# EAGLE design RF_INPUT (EAGLE 7.4.0)
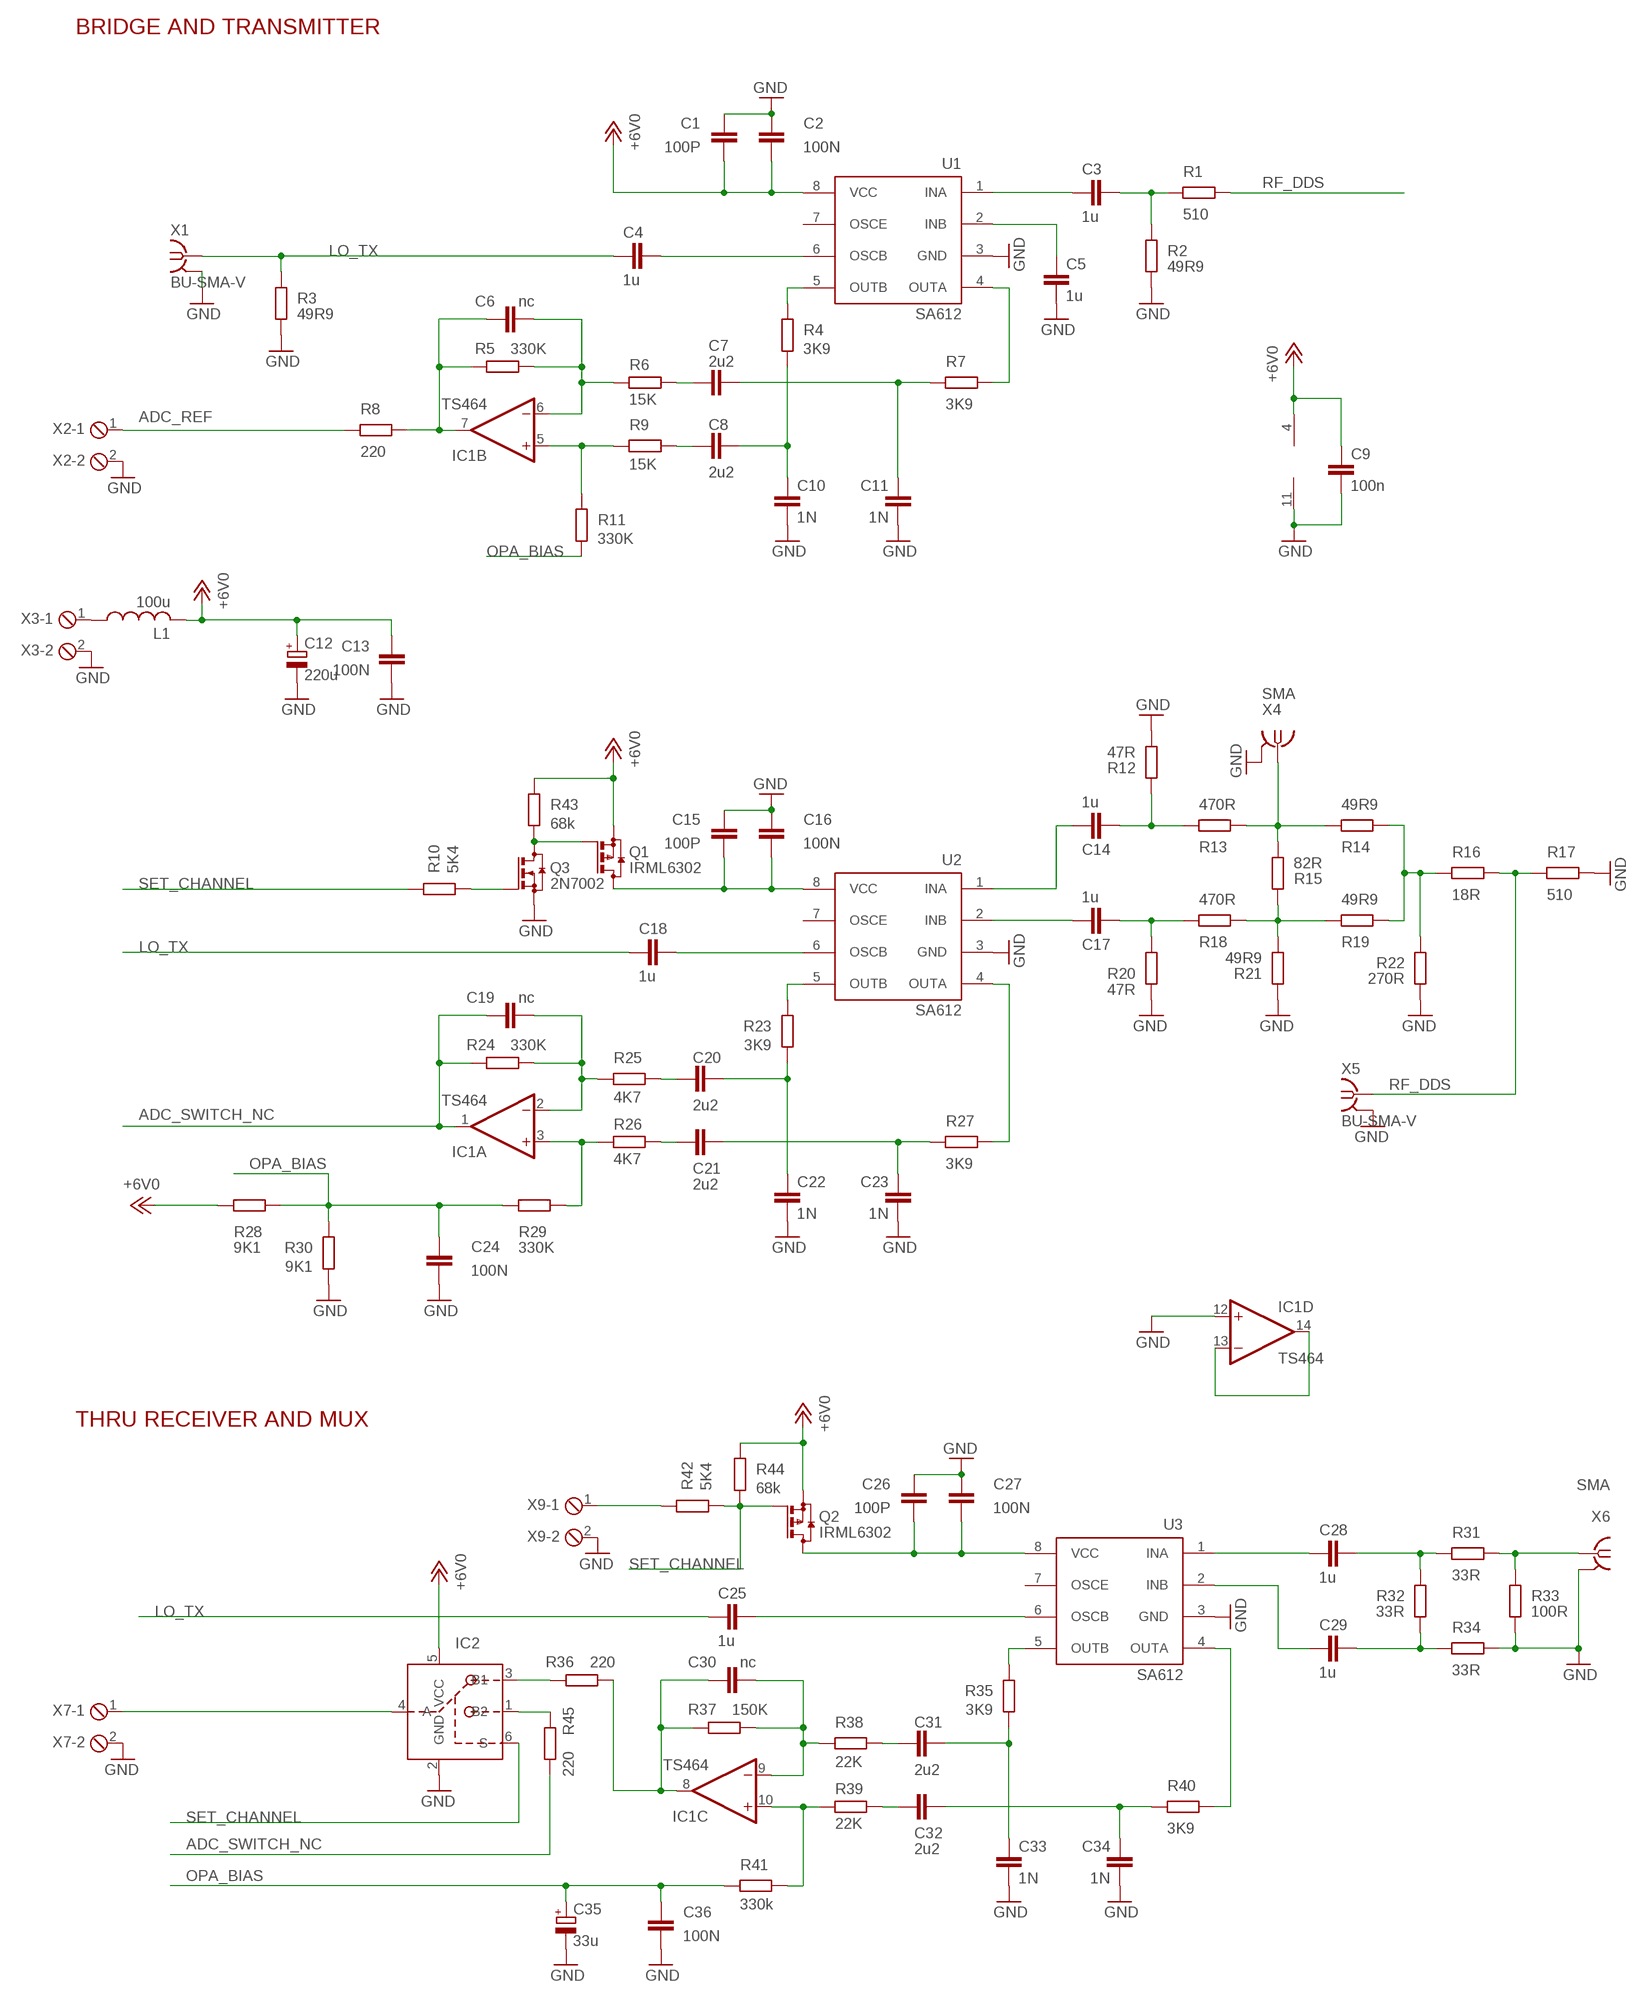
[diagram p0: schematic, sheet 1]

## Parts
C1  100P  C-EUC0805  [C0805]
C2  100N  C-EUC0603  [C0603]
C3  1u  C-EUC0603  [C0603]
C4  1u  C-EUC0805  [C0805]
C5  1u  C-EUC0603  [C0603]
C6  nc  C-EUC0805  [C0805]
C7  2u2  C-EUC0805  [C0805]
C8  2u2  C-EUC0805  [C0805]
C9  100n  C-EUC0603  [C0603]
C10  1N  C-EUC0805  [C0805]
C11  1N  C-EUC0805  [C0805]
C12  220u  CPOL-EU153CLV-0605  [153CLV-0605]
C13  100N  C-EUC0603  [C0603]
C14  1u  C-EUC0603  [C0603]
C15  100P  C-EUC0805  [C0805]
C16  100N  C-EUC0603  [C0603]
C17  1u  C-EUC0603  [C0603]
C18  1u  C-EUC0805  [C0805]
C19  nc  C-EUC0805  [C0805]
C20  2u2  C-EUC0805  [C0805]
C21  2u2  C-EUC0805  [C0805]
C22  1N  C-EUC0805  [C0805]
C23  1N  C-EUC0805  [C0805]
C24  100N  C-EUC0603  [C0603]
C25  1u  C-EUC0805  [C0805]
C26  100P  C-EUC0805  [C0805]
C27  100N  C-EUC0603  [C0603]
C28  1u  C-EUC0603  [C0603]
C29  1u  C-EUC0603  [C0603]
C30  nc  C-EUC0805  [C0805]
C31  2u2  C-EUC0805  [C0805]
C32  2u2  C-EUC0805  [C0805]
C33  1N  C-EUC0805  [C0805]
C34  1N  C-EUC0805  [C0805]
C35  33u  CPOL-EU153CLV-0605  [153CLV-0605]
C36  100N  C-EUC0603  [C0603]
IC1  TS464  AD8684R  [SO14]
IC2  SN74LVC1G3157DBVR  [SOT23-6]
L1  100u  L-US0207/12  [0207/12]
Q1  IRML6302  BSS84  [SOT23]
Q2  IRML6302  BSS84  [SOT23]
Q3  2N7002  BSS123  [SOT23]
R1  510  R-EU_R0603  [R0603]
R2  49R9  R-EU_R0805  [R0805]
R3  49R9  R-EU_R0805  [R0805]
R4  3K9  R-EU_R0603  [R0603]
R5  330K  R-EU_R0603  [R0603]
R6  15K  R-EU_R0603  [R0603]
R7  3K9  R-EU_R0603  [R0603]
R8  220  R-EU_R0603  [R0603]
R9  15K  R-EU_R0603  [R0603]
R10  5K4  R-EU_R0603  [R0603]
R11  330K  R-EU_R0603  [R0603]
R12  47R  R-EU_R0603  [R0603]
R13  470R  R-EU_R0603  [R0603]
R14  49R9  R-EU_R0805  [R0805]
R15  82R  R-EU_R0603  [R0603]
R16  18R  R-EU_R0603  [R0603]
R17  510  R-EU_R0603  [R0603]
R18  470R  R-EU_R0603  [R0603]
R19  49R9  R-EU_R0805  [R0805]
R20  47R  R-EU_R0603  [R0603]
R21  49R9  R-EU_R0805  [R0805]
R22  270R  R-EU_R0603  [R0603]
R23  3K9  R-EU_R0603  [R0603]
R24  330K  R-EU_R0603  [R0603]
R25  4K7  R-EU_R0603  [R0603]
R26  4K7  R-EU_R0603  [R0603]
R27  3K9  R-EU_R0603  [R0603]
R28  9K1  R-EU_R0603  [R0603]
R29  330K  R-EU_R0603  [R0603]
R30  9K1  R-EU_R0603  [R0603]
R31  33R  R-EU_R0603  [R0603]
R32  33R  R-EU_R0603  [R0603]
R33  100R  R-EU_R0603  [R0603]
R34  33R  R-EU_R0603  [R0603]
R35  3K9  R-EU_R0603  [R0603]
R36  220  R-EU_R0603  [R0603]
R37  150K  R-EU_R0603  [R0603]
R38  22K  R-EU_R0603  [R0603]
R39  22K  R-EU_R0603  [R0603]
R40  3K9  R-EU_R0603  [R0603]
R41  330k  R-EU_R0603  [R0603]
R42  5K4  R-EU_R0603  [R0603]
R43  68k  R-EU_R0603  [R0603]
R44  68k  R-EU_R0603  [R0603]
R45  220  R-EU_R0603  [R0603]
U1  SA612  [SO8]
U2  SA612  [SO8]
U3  SA612  [SO8]
X1  BU-SMA-V  [BU-SMA-V]
X2  MPT2  [2POL254]
X3  MPT2  [2POL254]
X4  SMA  SMA-142-0701-801/806  [J502-ND-142-0701-801/806]
X5  BU-SMA-V  [BU-SMA-V]
X6  SMA  SMA-142-0701-801/806  [J502-ND-142-0701-801/806]
X7  MPT2  [2POL254]
X9  MPT2  [2POL254]

## Nets
+6V0: C1.1 C2.1 C9.1 C12.+ C13.1 IC1.4(P:V+) IC2.5(VCC) L1.2 Q1.2(S) Q2.2(S) R28.2 R43.1 R44.1 U1.8(VCC)
ADC_REF: R8.1 X2.1
ADC_SWITCH_NC: C19.1 IC1.1(A:OUT) R24.2 R45.1
ADC_SWITCH_NO: C30.1 IC1.8(C:OUT) R36.1 R37.2
ADC_SWITCH_NO2: C6.1 IC1.7(B:OUT) R5.2 R8.2
GND: C1.2 C2.2 C5.2 C9.2 C10.2 C11.2 C12.- C13.2 C15.2 C16.2 C22.2 C23.2 C24.1 C26.2 C27.2 C33.2 C34.2 C35.- C36.2 IC1.11(P:V-) IC1.12(D:+IN) IC2.2(GND) Q3.2(S) R2.1 R3.2 R12.2 R17.2 R20.1 R21.1 R22.2 R30.2 R33.2 R34.1 U1.3(GND) U2.3(GND) U3.3(GND) X1.2 X1.3 X1.4 X1.5 X2.2 X3.2 X4.G@1 X4.G@2 X4.G@3 X4.G@4 X5.2 X5.3 X5.4 X5.5 X6.G@1 X6.G@2 X6.G@3 X6.G@4 X7.2 X9.2
LO_TX: C4.1 C18.1 C25.1 R3.1 X1.1
N$1: R15.1 R18.1 R19.2 R21.2
N$2: IC2.3(B1) R36.2
N$3: C25.2 U3.6(OSCB)
N$4: C26.1 C27.1 Q2.3(D) U3.8(VCC)
N$5: R13.1 R14.2 R15.2 X4.1
N$6: Q1.1(G) Q3.3(D) R43.2
N$7: L1.1 X3.1
N$8: C15.1 C16.1 Q1.3(D) U2.8(VCC)
N$9: R42.1 X9.1
N$11: IC2.1(B2) R45.2
N$12: IC2.4(A) X7.1
N$14: Q3.1(G) R10.2
N$30: R31.1 R33.1 X6.1
N$31: C28.2 R31.2 R32.1
N$32: C29.2 R32.2 R34.2
N$33: C29.1 U3.2(INB)
N$34: C28.1 U3.1(INA)
N$35: C31.2 C33.1 R35.2
N$36: R40.1 U3.4(OUTA)
N$37: C32.2 C34.1 R40.2
N$38: R35.1 U3.5(OUTB)
N$39: C17.1 U2.2(INB)
N$41: C30.2 IC1.9(C:-IN) R37.1 R38.2
N$42: C17.2 R18.2 R20.2
N$43: C31.1 R38.1
N$44: C32.1 R39.1
N$46: IC1.13(D:-IN) IC1.14(D:OUT)
N$47: IC1.10(C:+IN) R39.2 R41.1
N$49: C14.1 U2.1(INA)
N$51: C20.2 C22.1 R23.2
N$52: R27.1 U2.4(OUTA)
N$53: C21.2 C23.1 R27.2
N$54: R23.1 U2.5(OUTB)
N$55: C19.2 IC1.2(A:-IN) R24.1 R25.2
N$56: C20.1 R25.1
N$57: C21.1 R26.1
N$59: IC1.3(A:+IN) R26.2 R29.1
N$60: C14.2 R12.1 R13.2
N$61: C18.2 U2.6(OSCB)
N$62: C5.1 U1.2(INB)
N$63: R14.1 R16.2 R19.1 R22.1
N$64: C3.1 U1.1(INA)
N$65: C8.2 C10.1 R4.2
N$66: R7.1 U1.4(OUTA)
N$67: C7.2 C11.1 R7.2
N$68: R4.1 U1.5(OUTB)
N$69: C6.2 IC1.6(B:-IN) R5.1 R6.2
N$70: C8.1 R9.1
N$71: C7.1 R6.1
N$73: IC1.5(B:+IN) R9.2 R11.1
N$74: C3.2 R1.2 R2.2
N$76: C4.2 U1.6(OSCB)
OPA_BIAS: C24.2 C35.+ C36.1 R11.2 R28.1 R29.2 R30.1 R41.2
RF_DDS: R1.1 R16.1 R17.1 X5.1
SET_CHANNEL: IC2.6(S) Q2.1(G) R10.1 R42.2 R44.2
Unconnected: U1.7(OSCE) U2.7(OSCE) U3.7(OSCE)

## Notes on the sheet
- BRIDGE AND TRANSMITTER
- THRU RECEIVER AND MUX

## Library data of the parts
C1-C11 C13-C34 C36 = rcl:C-EU: CAPACITOR, European symbol
C12 C35 = rcl:CPOL-EU: POLARIZED CAPACITOR, European symbol
IC1 = linear:AD8684: Quad Low Power, High Speed JFET Operational Amplifiers Source: http://www.analog.com/UploadedFiles/Data_Sheets/AD8682_8684.pdf
IC2 = balmer:SN74LVC1G3157DBVR: SINGLE-POLE DOUBLE-THROW ANALOG SWITCH
L1 = rcl:L-US: INDUCTOR, American symbol
Q1 Q2 = transistor-small-signal:BSS84: P-CHANNEL MOS FET
Q3 = transistor-small-signal:BSS123: N-CHANNEL MOS FET
R1-R45 = rcl:R-EU_: RESISTOR, European symbol
U1-U3 = vnwa:SA612
X1 X5 = con-coax:BU-SMA-V: FEMALE SMA CONNECTOR Radiall distributor RS 112-3794; OC_FARNELL: unknown; OC_NEWARK: unknown
X2 X3 X7 X9 = con-phoenix-254:MPT2: PHOENIX CONNECTOR; OC_FARNELL: unknown; OC_NEWARK: unknown
X4 X6 = con-coax:SMA-: SMA 50 Ohm End Launch Jack Receptacle - Round Contact Johnson Components Source: www.johnsoncomponents.com .. J502-ND.pdf; MF: JOHNSON COMPONENTS; MPN: 142-0701-801; OC_FARNELL: 1608592; OC_NEWARK: 90F2624

## Board
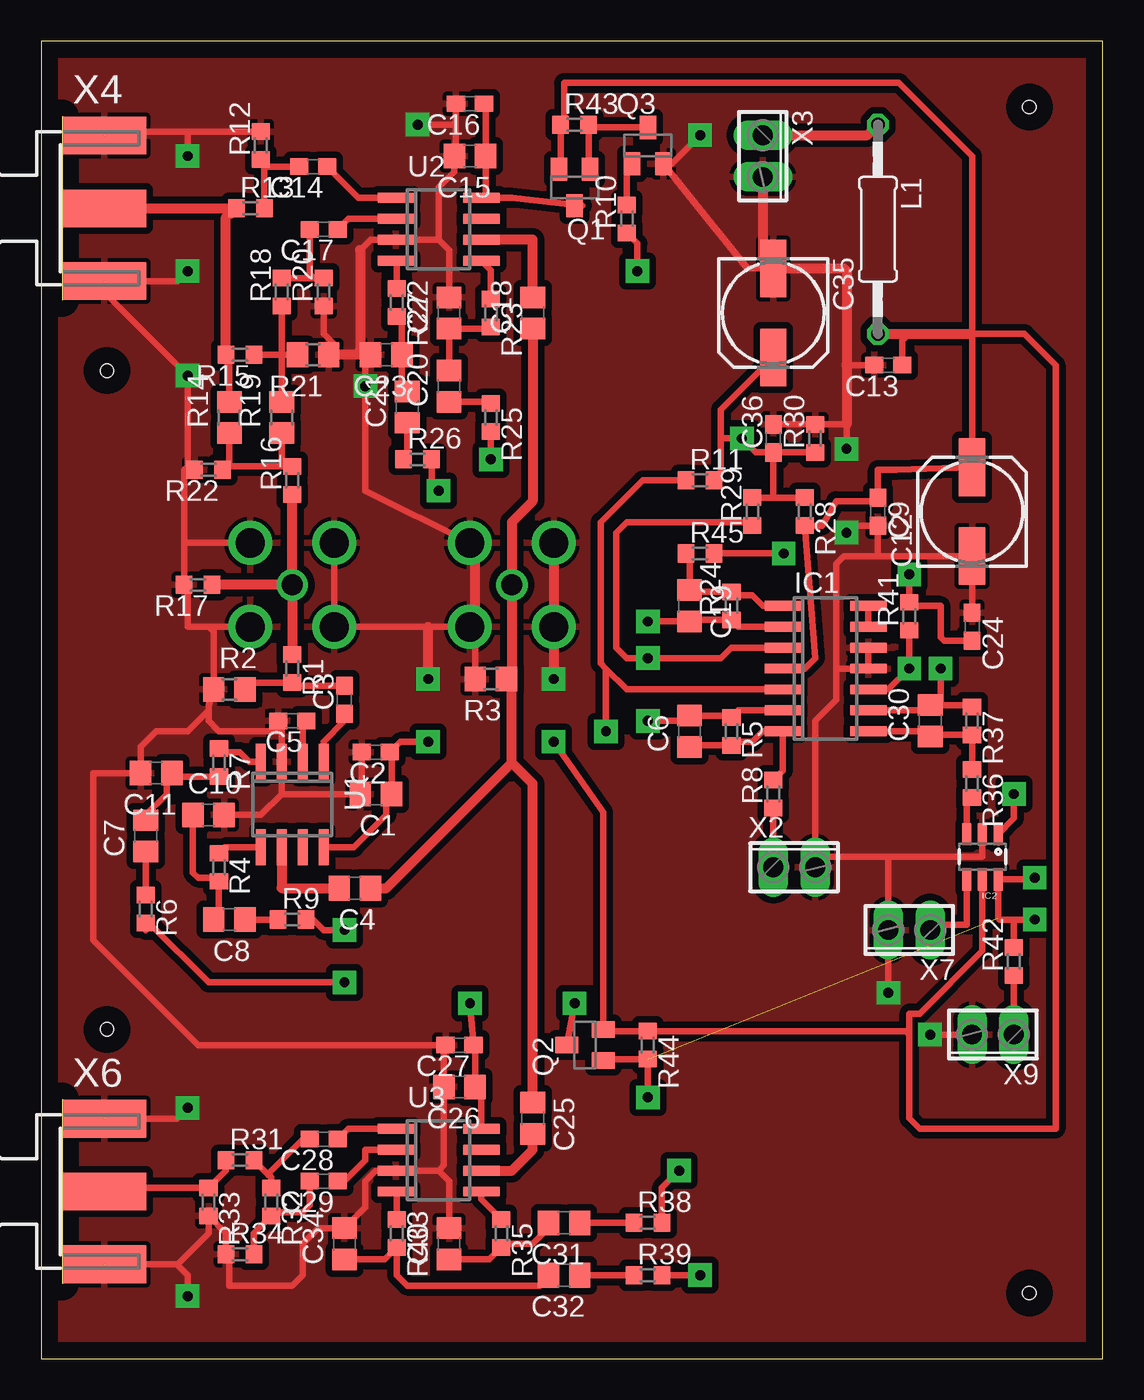
[diagram p1: board, top side]
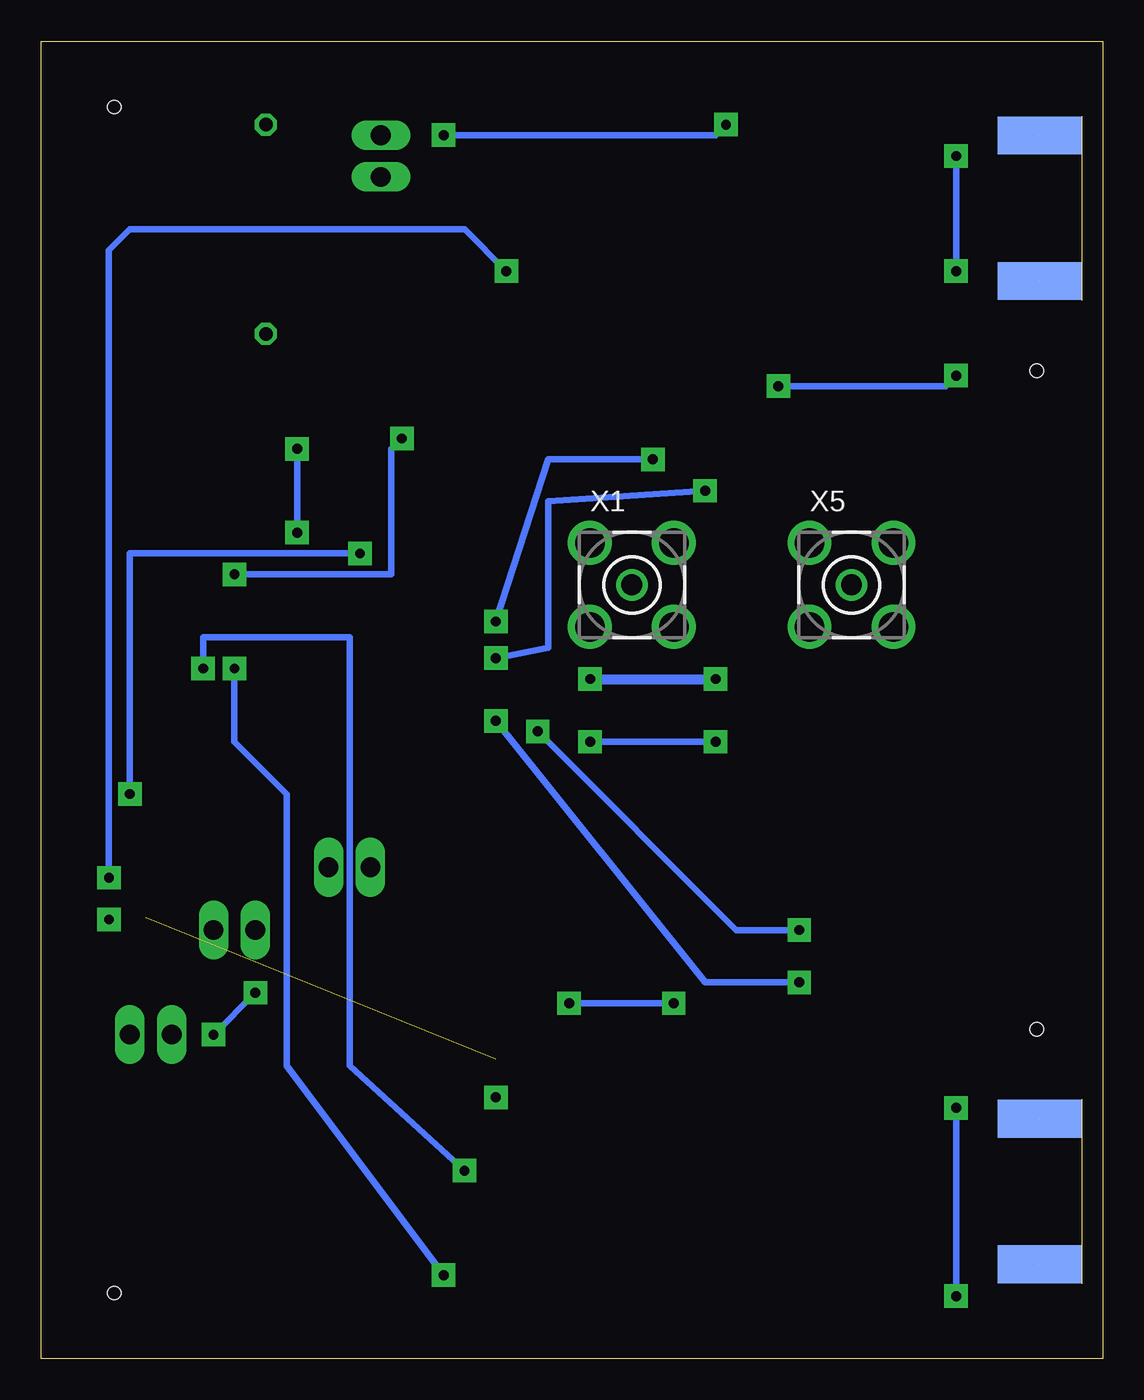
[diagram p2: board, bottom side, seen from below]

Size 64.44 x 80 mm. Coordinates in mm from the lower left corner, seen from the top.
Outline: 0,0 64.44,0 64.44,80 0,80 0,0
Copper layers (1*16): Top 0.035mm / dielectric 1.5mm / Bottom 0.035mm
Design rules "default": minimum track width 10mil, minimum drill 24mil, track to track 8mil, track to pad 8mil, pad to pad 8mil, via to via 8mil, smd to smd 8mil, copper to edge 40mil, drill to drill 8mil, minimum pad ring 10mil, minimum via ring 8mil, stop-mask expansion 4mil, vias tented up to drill 0mil, thermal gap 10mil
Holes 0.8 mm at 4,20 4,60 60,4 60,76

### Footprints (pad centres in the part's own frame; a part is rotated, then mirrored left to right if it is on the bottom)
C0805 = smd 1.3 x 1.5: 1 -0.95,0; 2 0.95,0
C0603 = smd 1.1 x 1: 1 -0.85,0; 2 0.85,0
153CLV-0605 = smd 3.5 x 1.6: + 2.7,0; - -2.7,0
SO14 = smd 0.6 x 2.2: 1 -3.81,-2.6; 2 -2.54,-2.6; 3 -1.27,-2.6; 4 0,-2.6; 5 1.27,-2.6; 6 2.54,-2.6; 7 3.81,-2.6; 8 3.81,2.6; 9 2.54,2.6; 10 1.27,2.6; 11 0,2.6; 12 -1.27,2.6; 13 -2.54,2.6; 14 -3.81,2.6
SOT23-6 = smd 0.55 x 1.35: 1 -0.95,-1.375; 2 0,-1.375; 3 0.95,-1.375; 4 0.95,1.375; 5 0,1.375; 6 -0.95,1.375
0207/12 = drill 0.813 octagon: 1 -6.35,0; 2 6.35,0
SOT23 = smd 1 x 1.4: 1 -0.95,-1.1; 2 0.95,-1.1; 3 0,1.1
R0603 = smd 1 x 1.1: 1 -0.85,0; 2 0.85,0
R0805 = smd 1.3 x 1.5: 1 -0.95,0; 2 0.95,0
SO8 = smd 0.6 x 2.2: 1 -1.905,-2.6; 2 -0.635,-2.6; 3 0.635,-2.6; 4 1.905,-2.6; 5 1.905,2.6; 6 0.635,2.6; 7 -0.635,2.6; 8 -1.905,2.6
BU-SMA-V = drill 1.27: 1 0,0 | drill 1.778: 2 -2.55,2.55; 3 2.55,2.55; 4 2.55,-2.55; 5 -2.55,-2.55
2POL254 = drill 1.2 long: 1 -1.27,0; 2 1.27,0
J502-ND-142-0701-801/806 = smd 5.08 x 2.286: 1 2.565,0; G@1 2.565,4.42; G@2 2.565,-4.42 | smd 5.08 x 2.286 bottom: G@3 2.565,4.42; G@4 2.565,-4.42

### Placement (x,y rotation side)
C1  20.32,34.29 180 top
C2  20.32,36.83 180 top
C3  18.41,40.01 90 top
C4  19.05,28.57 180 top
C5  15.24,38.73 180 top
C6  39.37,38.1 90 top
C7  6.35,31.75 90 top
C8  11.43,26.67 180 top
C9  50.8,51.44 270 top
C10  10.16,33.02 0 top
C11  6.99,35.56 180 top
C12  56.52,51.44 90 top
C13  51.44,60.33 180 top
C14  16.51,72.39 180 top
C15  26.04,73.03 180 top
C16  26.04,76.2 180 top
C17  17.14,68.58 180 top
C18  29.84,63.5 90 top
C19  39.37,45.72 270 top
C20  24.77,59.05 90 top
C21  22.23,57.78 90 top
C22  24.77,63.5 90 top
C23  20.95,60.96 180 top
C24  56.52,44.45 270 top
C25  29.84,14.61 270 top
C26  25.4,16.51 180 top
C27  25.4,19.05 180 top
C28  17.14,13.34 180 top
C29  17.14,10.79 180 top
C30  53.98,38.73 90 top
C31  31.75,8.26 180 top
C32  31.75,5.08 180 top
C33  24.77,6.99 90 top
C34  18.41,6.99 90 top
C35  44.45,63.5 270 top
C36  44.45,55.88 90 top
IC1  47.62,41.91 270 top
IC2  57.15,30.48 180 top
L1  50.8,68.58 270 top
Q1  32.38,71.12 180 top
Q2  33.02,19.05 90 top
Q3  36.83,73.66 0 top
R1  15.24,41.91 270 top
R2  11.43,40.64 0 top
R3  27.3,41.27 180 top
R4  10.79,29.84 270 top
R5  41.91,38.1 270 top
R6  6.35,27.3 270 top
R7  10.79,36.2 270 top
R8  44.45,34.29 90 top
R9  15.24,26.67 0 top
R10  35.56,69.22 90 top
R11  40.01,53.34 0 top
R12  13.34,73.66 90 top
R13  12.7,69.85 0 top
R14  11.43,57.15 90 top
R15  12.06,60.96 180 top
R16  15.24,53.34 90 top
R17  9.53,46.99 180 top
R18  14.61,64.77 90 top
R19  14.61,57.15 90 top
R20  17.14,64.77 90 top
R21  16.51,60.96 180 top
R22  10.16,53.98 180 top
R23  27.3,63.5 270 top
R24  41.91,45.72 90 top
R25  27.3,57.15 270 top
R26  22.86,54.61 0 top
R27  21.59,64.14 270 top
R28  46.35,51.44 270 top
R29  43.18,51.44 90 top
R30  46.99,55.88 90 top
R31  12.06,12.06 0 top
R32  13.97,9.53 270 top
R33  10.16,9.53 270 top
R34  12.06,6.35 0 top
R35  27.94,7.62 270 top
R36  56.52,34.92 270 top
R37  56.52,38.73 270 top
R38  36.83,8.26 0 top
R39  36.83,5.08 0 top
R40  21.59,7.62 270 top
R41  52.7,45.09 90 top
R42  59.05,24.13 90 top
R43  32.38,74.93 0 top
R44  36.83,19.05 270 top
R45  40.01,48.9 0 top
U1  15.24,33.66 180 top
U2  24.13,68.58 270 top
U3  24.13,12.06 270 top
X1  28.57,46.99 0 bottom
X2  45.72,29.84 0 top
X3  43.81,73.03 270 top
X4  1.27,69.85 0 top
X5  15.24,46.99 0 bottom
X6  1.27,10.16 0 top
X7  52.7,26.04 180 top
X9  57.78,19.68 180 top

### Tracks (layer width: path | path; a pad name or v marks a point on that pad's centre or on a via)
+6V0  (via drill 0.6 pad 1.42)
  Top 0.406: IC1.4 46.35,41.91 46.99,42.55 R28.2 47.41,50.59 48.26,52.07 50.59,52.07 C9.1 50.8,53.98 51.91,53.98 C12.+ 56.52,62.23 | Q1.2 31.54,72.32 R43.1 31.75,75.14 31.75,77.47 52.07,77.47 56.52,73.03 56.52,62.23 | U1.8 18.99,31.05 20.95,33.02 20.95,33.98 C1.1 21.27,36.73 C2.1 21.8,37.47 v23.5,37.47 | v31.11,37.47 34.12,33.19 Q2.2 34.22,19.9 R44.1 52.49,19.9 52.7,19.68 | C13.1 52.28,61.81 52.7,62.23 | IC2.5 57.15,24.77 53.34,20.95 52.7,20.95 52.7,19.68 | 56.52,62.23 59.69,62.23 61.59,60.33 61.59,13.97 53.34,13.97 52.7,14.61 52.7,19.68
  Top 0.61: L1.2 52.7,62.23 56.52,62.23
  Bottom 0.406: v31.11,37.47 v23.5,37.47
ADC_REF
  Top 0.406: X2.1 R8.1
ADC_SWITCH_NC
  Top 0.406: IC1.1 43.81,45.72 43.18,46.35 42.12,46.35 R24.2 39.47,46.57 C19.1 39.37,48.68 R45.1
ADC_SWITCH_NO
  Top 0.406: IC1.8 53.66,38.1 C30.1 54.08,37.88 R37.2 R36.1
ADC_SWITCH_NO2
  Top 0.406: R8.2 45.02,35.72 IC1.7 43.81,38.1 43.18,37.47 42.12,37.47 R5.2 39.47,37.25 C6.1
GND  (via drill 0.6 pad 1.42)  (4 unrouted)
  Top 0.406: 10.16,44.45 8.89,44.45 8.89,46.99 R17.2 8.68,49.53 | 10.16,44.45 X5.4 | R22.2 8.68,53.98 | 8.68,53.98 8.68,49.53 | 8.68,53.98 8.89,54.19 v8.89,59.69 3.83,64.75 X4.G@4 8.28,65.43 v8.89,66.04 | R12.2 8.89,74.51 | 8.89,74.51 4.08,74.51 X4.G@3 | C22.2 24.77,67.31 24.13,67.94 | 24.13,67.94 U2.3 20,67.94 19.37,67.31 | 8.26,5.71 10.16,7.62 R33.2 11.21,7.62 R34.1 11.43,6.13 11.43,4.45 15.24,4.45 15.88,5.08 15.88,6.99 16.82,7.93 C34.2 19.68,9.21 19.68,10.79 20.32,11.43 U3.3 24.13,11.43 | X6.G@4 8.23,5.74 8.26,5.71 | C33.2 24.77,10.79 24.13,11.43 | C16.2 25.18,74.93 | 25.18,74.93 25.18,73.12 C15.2 25.09,72.08 24.13,71.12 24.13,67.94 | 24.13,11.43 24.45,11.75 C26.2 24.45,18.95 C27.2 9.53,19.05 3.17,25.4 3.17,35.56 C11.2 6.04,37.15 6.99,38.1 8.89,38.1 10.16,39.37 | X6.G@3 8.23,14.58 v8.89,15.24 | v8.89,3.81 8.89,5.08 8.26,5.71 | 48.26,41.91 48.26,40.01 46.99,38.73 X2.2 47.62,30.48 51.44,30.48 | 48.26,41.91 IC1.11 IC1.12 | IC2.2 57.15,30.48 51.44,30.48 | 50.8,48.73 C12.- C24.1 | 50.8,48.73 48.73,48.73 48.26,48.26 48.26,41.91 | 50.8,48.73 C9.2 49.31,50.59 v48.9,50.16 | v8.89,73.03 8.89,74.51 | X5.3 8.69,49.54 8.68,49.53 | X5.2 X5.5 23.5,44.44 X1.4 26.36,44.11 R3.2 | 10.16,44.45 10.48,44.13 R2.1 10.16,39.69 10.16,39.37 | 14.61,38.1 U1.3 14.61,34.29 | 14.61,38.1 10.79,38.1 10.16,38.73 10.16,39.37 | C5.2 14.39,38.31 14.61,38.1 | C10.2 13.34,33.02 14.61,34.29 | C2.2 19.47,34.39 C1.2 14.61,34.29 | X1.3 19.68,52.72 v19.68,59.05 19.68,60.96 C23.2 | C35.- 42.87,66.2 Q3.2 38.27,72.56 v40.01,74.3 | v22.86,74.93 25.18,74.93 | C36.2 R30.2 48.9,56.73 v48.9,55.24 | 51.44,30.48 X7.2 v51.44,22.23 | C13.2 48.9,60.33
  Top 0.406: X9.2 v53.98,19.68 | R20.1 17.14,62.23 17.78,61.59 17.78,61.28 R21.1
  Top 0.61: 26.36,44.11 26.36,49.21 X1.3 | 48.9,56.73 48.9,60.33 48.9,66.04 48.73,66.2 C35.- 43.81,66.83 X3.2 | 19.37,67.31 19.37,61.28 19.68,60.96 R21.1 | v31.11,41.27 31.12,41.28 X1.5 X1.2 | v23.5,41.27 23.5,44.44
  Bottom 0.406: v19.68,59.05 9.53,59.05 v8.89,59.69 | v8.89,15.24 v8.89,3.81 | v8.89,66.04 v8.89,73.03 | v40.01,74.3 23.5,74.3 v22.86,74.93 | v53.98,19.68 v51.44,22.23 | v48.9,50.16 v48.9,55.24
  Bottom 0.61: v31.11,41.27 v23.5,41.27
  pour Top (isolate 0.406): 0,80.01 64.14,80.01 64.14,0 0,0
LO_TX
  Top 0.61: C4.1 20.95,28.57 28.57,36.2 | 28.57,36.2 28.57,40.95 R3.1 28.57,41.59 X1.1 28.57,50.8 29.84,52.07 C18.1 | C25.1 29.84,34.92 28.57,36.2
N$1
  Top 0.406: R19.2 14.61,60.96 | 14.61,60.96 R15.1 | 14.61,60.96 R21.2 | R18.1 14.61,60.96
N$2
  Top 0.406: IC2.3 56.2,33.76 R36.2
N$3
  Top 0.61: U3.6 28.57,11.43 29.84,12.7 C25.2
N$4  (via drill 0.6 pad 1.42)
  Top 0.406: U3.8 26.73,16.13 C26.1 26.35,18.95 C27.1 v26.04,21.59 | Q2.3 v32.38,21.59
  Bottom 0.406: v32.38,21.59 v26.04,21.59
N$5
  Top 0.406: R14.2 11.43,60.33 11.21,60.54 R15.2
  Top 0.61: X4.1 R13.1 11.53,69.53 11.43,69.53 11.21,69.32 R15.2
N$6
  Top 0.406: Q1.1 33.23,72.32 R43.2 33.23,74.76 Q3.3
N$7
  Top 0.61: X3.1 50.16,74.3 L1.1
N$8
  Top 0.406: C16.1 26.98,76.1 C15.1 26.98,70.74 U2.8 28.57,70.48 32.85,70.02 Q1.3
N$9
  Top 0.406: R42.1 X9.1
N$11  (via drill 0.6 pad 1.42)
  Top 0.406: v59.05,34.29 59.05,32.81 IC2.1 | v45.09,48.9 R45.2
  Bottom 0.406: v45.09,48.9 59.05,48.9 v59.05,34.29
N$12
  Top 0.406: IC2.4 56.2,26.36 54.3,26.36 X7.1
N$14
  Top 0.406: Q3.1 35.56,72.56 R10.2
N$30
  Top 0.406: X6.1 4.05,10.38 R33.1 11.21,11.43 R31.1
N$31
  Top 0.406: R32.1 13.97,11.01 13.76,11.22 | 13.76,11.22 R31.2 | C28.2 15.88,13.34 13.76,11.22
N$32
  Top 0.406: R34.2 12.91,7.62 R32.2 14.19,8.89 15.88,8.89 16.3,9.31 C29.2
N$33
  Top 0.406: C29.1 18.41,10.79 19.68,12.06 19.68,12.7 U3.2
N$34
  Top 0.406: U3.1 18.63,13.97 C28.1
N$35
  Top 0.406: C33.1 27.2,6.04 R35.2 28.16,6.99 29.84,6.99 30.9,8.04 C31.2
N$36
  Top 0.406: R40.1 21.59,10.1 U3.4
N$37
  Top 0.406: C34.1 20.86,6.04 R40.2 21.59,5.08 22.23,4.45 30.27,4.45 C32.2
N$38
  Top 0.406: U3.5 26.73,9.68 R35.1
N$39
  Top 0.406: U2.2 18.63,69.22 C17.1
N$41  (via drill 0.6 pad 1.42)
  Top 0.406: IC1.9 53.66,39.37 C30.2 54.61,39.69 | 54.61,39.69 56.41,39.69 R37.1 | R38.2 37.68,10.38 v38.73,11.43 | v54.61,41.91 54.61,39.69
  Bottom 0.406: v54.61,41.91 54.61,43.81 45.72,43.81 45.72,17.78 v38.73,11.43
N$42
  Top 0.406: C17.2 16.3,65.83 16.51,65.62 | R18.2 16.51,65.62 | 16.51,65.62 R20.2
N$43
  Top 0.406: C31.1 R38.1
N$44
  Top 0.406: C32.1 R39.1
N$46
  Top 0.406: IC1.13 IC1.14
N$47  (via drill 0.6 pad 1.42)
  Top 0.406: IC1.10 51.44,40.64 v52.7,41.91 R41.1 | v40.01,5.08 R39.2
  Bottom 0.406: v52.7,41.91 52.7,37.47 49.53,34.29 49.53,17.78 v40.01,5.08
N$49
  Top 0.406: U2.1 19.27,70.48 C14.1
N$51
  Top 0.406: R23.2 27.2,62.55 C22.1 C20.2
  Top 0.61: 24.45,62.23 C22.1
N$52
  Top 0.406: R27.1 21.59,66.61 U2.4
N$53
  Top 0.406: R27.2 21.91,62.97 C23.1 21.91,59.05 C21.2
N$54
  Top 0.406: R23.1 27.3,66.1 U2.5
N$55  (via drill 0.6 pad 1.42)
  Top 0.406: IC1.2 42.33,44.45 R24.1 39.47,44.87 C19.2 v36.83,44.77 | R25.2 v27.3,54.61
  Bottom 0.406: v27.3,54.61 33.66,54.61 v36.83,44.77
N$56
  Top 0.406: C20.1 27.2,58.1 R25.1
N$57
  Top 0.406: C21.1 22.23,54.83 R26.1
N$59  (via drill 0.6 pad 1.42)
  Top 0.406: IC1.3 41.91,43.18 41.27,42.55 v36.83,42.55 35.56,42.55 34.92,43.18 34.92,50.16 35.56,50.8 42.97,50.8 R29.1 | R26.2 23.71,53.12 v24.13,52.7
  Bottom 0.406: v24.13,52.7 33.66,52.07 33.66,43.18 v36.83,42.55
N$60
  Top 0.406: R13.2 13.55,72.59 R12.1 13.76,72.39 C14.2
N$61
  Top 0.61: C18.2 29.84,67.94 U2.6
N$62
  Top 0.406: U1.2 15.88,38.52 C5.1
N$63
  Top 0.406: R16.2 14.61,54.19 | 14.61,54.19 11.01,54.19 R22.1 11.43,54.4 R14.1 | R19.1 14.61,54.19
N$64
  Top 0.406: U1.1 17.14,37.47 18.41,38.73 C3.1
N$65
  Top 0.406: C10.1 9.21,29.52 9.53,29.21 10.58,29.21 R4.2 10.79,26.98 C8.2
N$66
  Top 0.406: U1.4 12.64,36.26 12.06,36.83 11.01,36.83 R7.1
N$67
  Top 0.406: C7.2 6.35,33.02 7.62,34.29 7.62,35.24 C11.1 8.15,35.34 R7.2
N$68
  Top 0.406: U1.5 11.15,31.05 R4.1
N$69  (via drill 0.6 pad 1.42)
  Top 0.406: 6.35,26.04 R6.2 6.57,26.45 10.16,22.86 v18.41,22.86 | IC1.6 42.33,39.37 R5.1 41.81,39.05 C6.2 39.05,38.73 v36.83,38.73
  Bottom 0.406: v18.41,22.86 24.13,22.86 v36.83,38.73
N$70
  Top 0.406: C8.1 R9.1
N$71
  Top 0.406: C7.1 R6.1
N$73  (via drill 0.6 pad 1.42)
  Top 0.406: IC1.5 35.56,40.64 34.29,41.91 | 34.29,41.91 33.97,42.23 33.97,50.8 36.51,53.34 R11.1 | R9.2 16.51,26.67 17.14,26.04 v18.41,26.04 | v34.29,38.1 34.29,41.91
  Bottom 0.406: v18.41,26.04 22.23,26.04 v34.29,38.1
N$74
  Top 0.406: R2.2 12.8,41.06 R1.2 15.45,40.85 C3.2
N$76
  Top 0.61: U1.6 14.61,28.57 C4.2
OPA_BIAS  (via drill 0.6 pad 1.42)
  Top 0.406: C36.1 R30.1 | 41.27,55.88 41.27,57.62 C35.+ | 41.27,55.88 41.27,53.76 R11.2 | C24.2 54.83,43.6 54.61,43.81 54.61,45.72 52.92,45.72 R41.2 v52.7,47.62 | 41.27,55.88 v42.55,55.88 43.4,55.03 C36.1 | R28.1 44.45,52.28 | 44.45,52.28 R29.2 | C36.1 44.45,52.28
  Bottom 0.406: v52.7,47.62 43.18,47.62 43.18,55.24 v42.55,55.88
RF_DDS
  Top 0.61: X5.1 R17.1 | X5.1 R16.1 | X5.1 R1.1
SET_CHANNEL  (via drill 0.6 pad 1.42)  (1 unrouted)
  Top 0.406: 58.2,29.21 IC2.6 | IC2.6 58.1,26.77 58.2,26.67 59.05,26.67 | IC2.6 60.22,29.11 v60.33,29.21 | v36.2,66.04 36.2,67.73 R10.1 | v36.83,15.88 R44.2 34.22,18.2 Q2.1 | v60.33,26.67 59.05,26.67 | R42.2 59.05,26.67
  Bottom 0.406: v60.33,29.21 60.33,67.31 59.05,68.58 38.73,68.58 v36.2,66.04